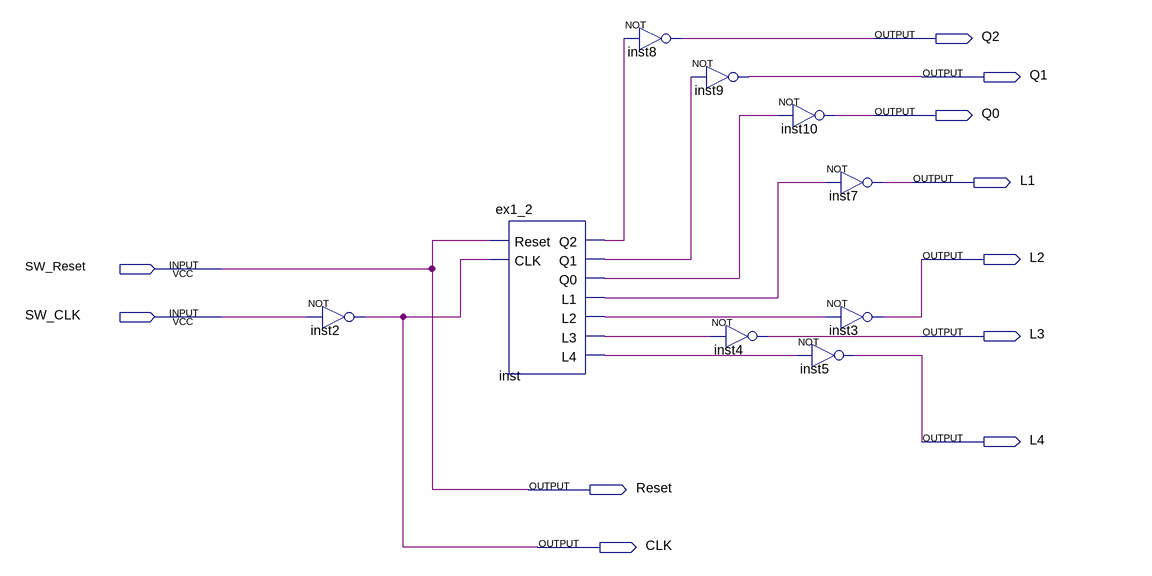
[diagram p0: schematic sheet]
// Quartus schematic iterface_dice.bdf as structural Verilog: 9 symbols, 11 pins
module iterface_dice (
  input  SW_Reset,
  input  SW_CLK,
  output Q2,
  output Q1,
  output Q0,
  output L1,
  output L2,
  output L3,
  output L4,
  output Reset,
  output CLK
);

  wire inst_l1, inst_l2, inst_l3, inst_l4, inst_q0, inst_q1, inst_q2;

  not inst2 (CLK, SW_CLK);
  ex1_2 inst (
    .Reset(SW_Reset), .CLK(CLK), .Q2(inst_q2), .Q1(inst_q1), .Q0(inst_q0), .L1(inst_l1), .L2(inst_l2),
    .L3(inst_l3), .L4(inst_l4));
  not inst8 (Q2, inst_q2);
  not inst9 (Q1, inst_q1);
  not inst4 (L3, inst_l3);
  not inst10 (Q0, inst_q0);
  not inst5 (L4, inst_l4);
  not inst7 (L1, inst_l1);
  not inst3 (L2, inst_l2);

  assign Reset = SW_Reset;
endmodule
